# EAGLE design lora-slim (EAGLE 6.5.0)
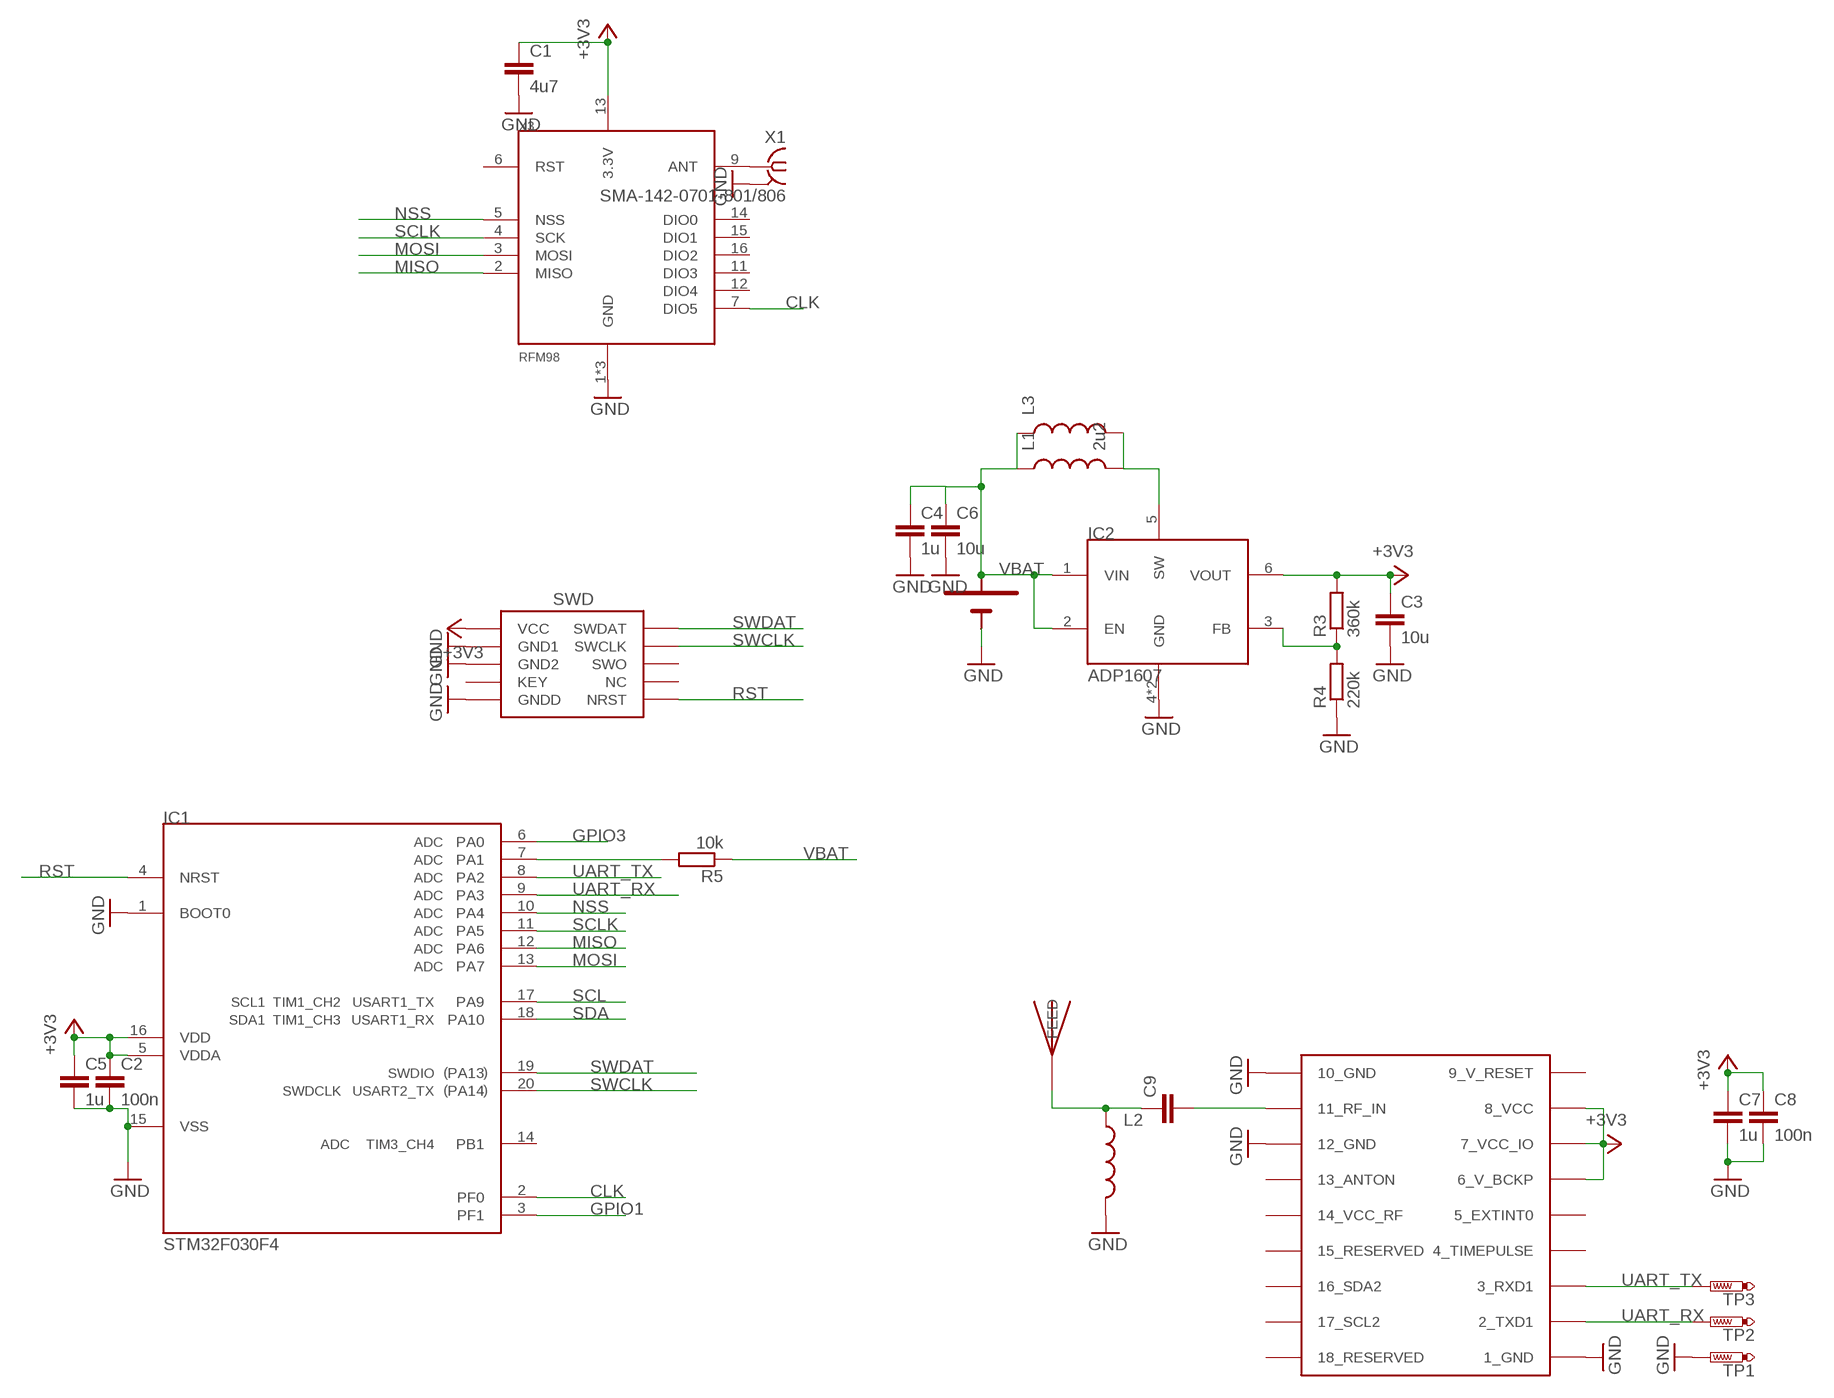
[diagram p0: schematic, sheet 1]

## Parts
C1  4u7  C-EUC0603  [C0603]
C2  100n  C-EUC0603  [C0603]
C3  10u  C-EUC0805  [C0805]
C4  1u  C-EUC0603  [C0603]
C5  1u  C-EUC0603  [C0603]
C6  10u  C-EUC0805  [C0805]
C7  1u  C-EUC0603  [C0603]
C8  100n  C-EUC0603  [C0603]
C9  C-EUC0603  [C0603]
IC1  STM32F030F4  [TSSOP20]
IC2  ADP1607  [LFCSP6]
J1  SWD_PTH_SHROUD  [SWD_PTH_SHROUD]
L1  2u2  INDUCTOR0805  [0805]
L2  INDUCTOR0603  [0603]
L3  INDUCTOR1210  [1210]
R3  360k  R-EU_R0603  [R0603]
R4  220k  R-EU_R0603  [R0603]
R5  10k  R-EU_R0603  [R0603]
TP1  PTR1B1,27  [B1,27]
TP2  PTR1B1,27  [B1,27]
TP3  PTR1B1,27  [B1,27]
U$5  JTI_ANTENNA-1575AT43A40  [JTI_ANTENNA-1575AT43A40]
U$6  KEYSTONE-53  [KEYSTONE53]
X1  SMA-142-0701-801/806  [J502-ND-142-0701-801/806]
X2  UBLOX_MAX  [UBLOX_MAX]
X3  RFM98  [RFM97]

## Nets
+3V3: C1.1 C2.1 C3.1 C5.1 C7.1 C8.1 IC1.5(VDDA) IC1.16(VDD) IC2.6(VOUT) J1.1(VCC) R3.2 X2.6_V_BCKP X2.7_VCC_IO X2.8_VCC X3.13(3.3V)
CLK: IC1.2(PF0) X3.7(DIO5)
GND: C1.2 C2.2 C3.2 C4.2 C5.2 C6.2 C7.2 C8.2 IC1.1(BOOT0) IC1.15(VSS) IC2.4(GND) IC2.EP(GND) J1.3(GND1) J1.5(GND2) J1.9(GNDD) L2.2 R4.1 TP1.TP U$6.N1(-) U$6.N2(-) X1.G@1 X1.G@2 X1.G@3 X1.G@4 X2.1_GND X2.10_GND X2.12_GND X3.1(GND) X3.8(GND) X3.10(GND)
GPIO1: IC1.3(PF1)
GPIO3: IC1.6(PA0)
MISO: IC1.12(PA6) X3.2(MISO)
MOSI: IC1.13(PA7) X3.3(MOSI)
N$1: C9.2 X2.11_RF_IN
N$2: X1.1 X3.9(ANT)
N$3: IC2.5(SW) L1.2 L3.2
N$4: C9.1 L2.1 U$5.FEED
N$6: IC2.3(FB) R3.1 R4.2
N$9: IC1.7(PA1) R5.2
NSS: IC1.10(PA4) X3.5(NSS)
RST: IC1.4(NRST) J1.10(NRST)
SCL: IC1.17(PA9)
SCLK: IC1.11(PA5) X3.4(SCK)
SDA: IC1.18(PA10)
SWCLK: IC1.20(PA14) J1.4(SWCLK)
SWDAT: IC1.19(PA13) J1.2(SWDAT)
UART_RX: IC1.9(PA3) TP2.TP X2.2_TXD1
UART_TX: IC1.8(PA2) TP3.TP X2.3_RXD1
VBAT: C4.1 C6.1 IC2.1(VIN) IC2.2(EN) L1.1 L3.1 R5.1 U$6.P1(+) U$6.P2(+)
Unconnected: IC1.14(PB1) J1.6(SWO) J1.7(KEY) J1.8(NC) X2.4_TIMEPULSE X2.5_EXTINT0 X2.13_ANTON X2.14_VCC_RF X2.15_RESERVED X2.16_SDA2 X2.17_SCL2 X2.18_RESERVED X3.6(RST) X3.11(DIO3) X3.12(DIO4) X3.14(DIO0) X3.15(DIO1) X3.16(DIO2)

## Power pins joined to a net without a drawn wire
9_V_RESET: X2.9_V_RESET

## Library data of the parts
C1-C9 = rcl:C-EU: CAPACITOR, European symbol
IC1 = dtb:STM32F030F4
IC2 = Mine:ADP1607
J1 = dtb:SWD_PTH_SHROUD
L1-L3 = SparkFun-Passives:INDUCTOR: Inductors Basic Inductor/Choke - 0603 and 1206. Footprints are not proven and vary greatly between part numbers. SRN6045- 33uH, 20% 1.4A SDR0403-560KL - 56uH, 10%, 500mA RMS/740mA peak
R3-R5 = rcl:R-EU_: RESISTOR, European symbol
TP1-TP3 = testpad:PTR1: TEST PIN
U$5 = Ava:JTI_ANTENNA-1575AT43A40
U$6 = Mine:KEYSTONE-53
X1 = con-coax:SMA-: SMA 50 Ohm End Launch Jack Receptacle - Round Contact Johnson Components Source: www.johnsoncomponents.com .. J502-ND.pdf; MF: JOHNSON COMPONENTS; MPN: 142-0701-801; OC_FARNELL: 1608592; OC_NEWARK: 90F2624
X2 = Ava:UBLOX_MAX: UBLOX MAX
X3 = Mine:RFM98

## Board
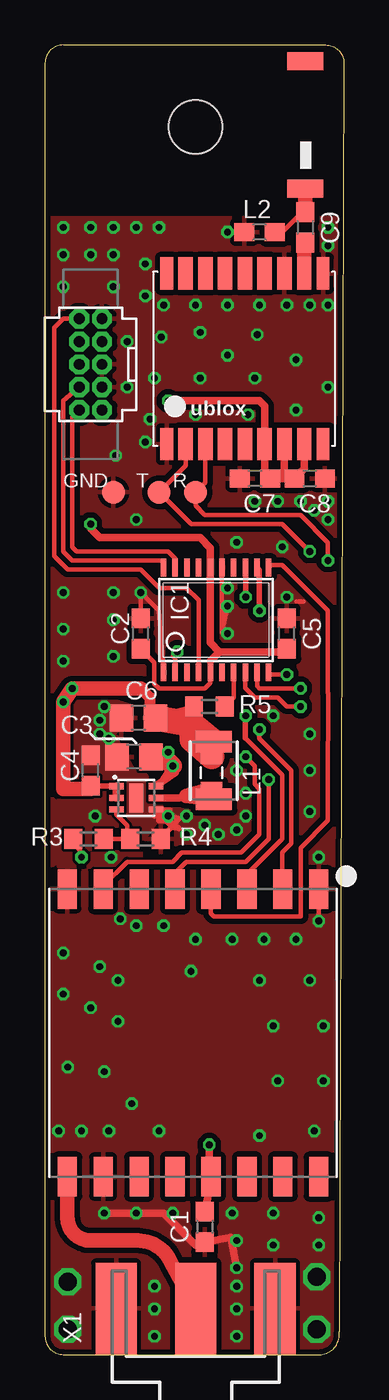
[diagram p1: board, top side]
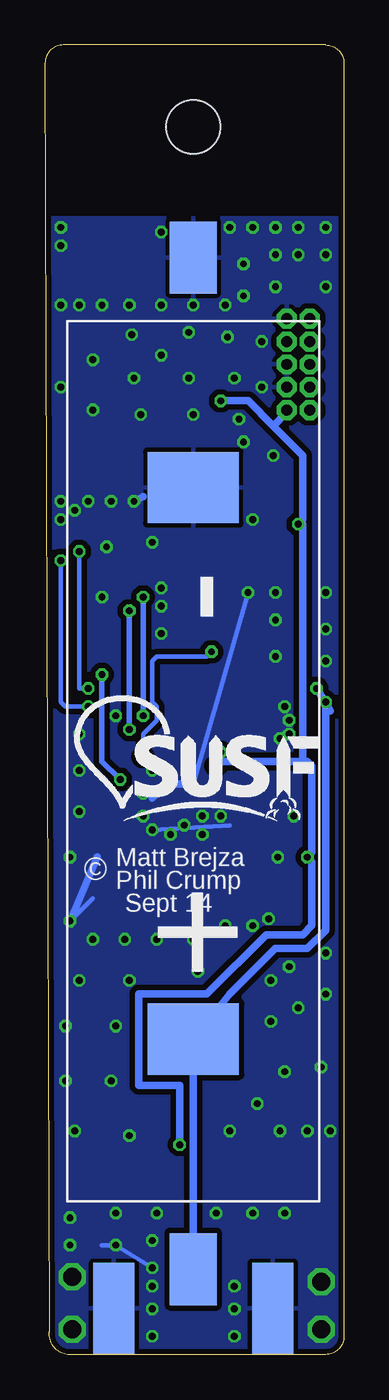
[diagram p2: board, bottom side, seen from below]

Size 16.64 x 72.9 mm. Coordinates in mm from the lower left corner, seen from the top.
Outline: 1.02,0 15.37,0 arc90 16.38,1.27 16.64,71.88 arc90 15.62,72.9 1.02,72.9 arc90 0,71.88 0,1.02 arc90 1.02,0
Copper layers (1*16): Top 0.035mm / dielectric 1.5mm / Bottom 0.035mm
Design rules "Hackvana *": minimum track width 7mil, minimum drill 12mil, track to track 6mil, track to pad 6mil, pad to pad 6mil, via to via 6mil, smd to smd 0mil, copper to edge 10mil, drill to drill 6mil, minimum pad ring 10mil, minimum via ring 6mil, stop-mask expansion 2mil, vias tented up to drill 100mil, thermal gap 10mil
Holes 3 mm at 8.38,68.33

### Footprints (pad centres in the part's own frame; a part is rotated, then mirrored left to right if it is on the bottom)
C0603 = smd 1.1 x 1: 1 -0.85,0; 2 0.85,0
C0805 = smd 1.3 x 1.5: 1 -0.95,0; 2 0.95,0
TSSOP20 = smd 0.305 x 0.991: 1 -2.925,-2.918; 2 -2.275,-2.918; 3 -1.625,-2.918; 4 -0.975,-2.918; 5 -0.325,-2.918; 6 0.325,-2.918; 7 0.975,-2.918; 8 1.625,-2.918; 9 2.275,-2.918; 10 2.925,-2.918; 11 2.925,2.918; 12 2.275,2.918; 13 1.625,2.918; 14 0.975,2.918; 15 0.325,2.918; 16 -0.325,2.918; 17 -0.975,2.918; 18 -1.625,2.918; 19 -2.275,2.918; 20 -2.925,2.918
LFCSP6 = smd 0.35 x 0.8: 1 -0.65,-1.1; 2 0,-1.1; 3 0.65,-1.1; 4 0.65,1.1; 5 0,1.1; 6 -0.65,1.1 | smd 1.6 x 0.8: EP 0,0
SWD_PTH_SHROUD = drill 0.6 octagon: 1 -2.54,-0.635; 2 -2.54,0.635; 3 -1.27,-0.635; 4 -1.27,0.635; 5 0,-0.635; 6 0,0.635; 7 1.27,-0.635; 8 1.27,0.635; 9 2.54,-0.635; 10 2.54,0.635
0805 = smd 0.8 x 1.2: 1 -0.9,0; 2 0.9,0
0603 = smd 1.1 x 1: 1 -0.85,0; 2 0.85,0
1210 = smd 1.2 x 2: 1 -1.6,0; 2 1.6,0
R0603 = smd 1 x 1.1: 1 -0.85,0; 2 0.85,0
B1,27 = smd 1.27 x 1.27: TP 0,0
JTI_ANTENNA-1575AT43A40 = smd 1 x 2: FEED -3.175,0; NC 3.925,0
KEYSTONE53 = smd 3.96 x 5.08: N1 14.73,0; P2 -15.97,0 | smd 4 x 2.6: N2 27.53,0; P1 -28.77,0
J502-ND-142-0701-801/806 = smd 5.08 x 2.286: 1 2.565,0; G@1 2.565,4.42; G@2 2.565,-4.42 | smd 5.08 x 2.286 bottom: G@3 2.565,4.42; G@4 2.565,-4.42
UBLOX_MAX = smd 1.8 x 0.7: 1_GND 4.95,-4.4; 9_V_RESET 4.95,4.3; 10_GND -4.55,4.3; 18_RESERVED -4.55,-4.4 | smd 1.8 x 0.8: 2_TXD1 4.95,-3.35; 3_RXD1 4.95,-2.25; 4_TIMEPULSE 4.95,-1.15; 5_EXTINT0 4.95,-0.05; 6_V_BCKP 4.95,1.05; 7_VCC_IO 4.95,2.15; 8_VCC 4.95,3.25; 11_RF_IN -4.55,3.25; 12_GND -4.55,2.15; 13_ANTON -4.55,1.05; 14_VCC_RF -4.55,-0.05; 15_RESERVED -4.55,-1.15; 16_SDA2 -4.55,-2.25; 17_SCL2 -4.55,-3.35
RFM97 = smd 2.184 x 1.067: 1 0,0; 2 0,-2; 3 0,-4; 4 0,-6; 5 0,-8; 6 0,-10; 7 0,-12; 8 0,-14; 9 16,-14; 10 16,-12; 11 16,-10; 12 16,-8; 13 16,-6; 14 16,-4; 15 16,-2; 16 16,0

### Placement (x,y rotation side)
C1  8.89,7.11 270 top
C2  5.33,40.13 90 top
C3  4.95,33.27 180 top
C4  2.54,32.51 90 top
C5  13.46,40.13 90 top
C6  5.21,35.43 180 top
C7  11.68,48.77 180 top
C8  14.73,48.77 0 top
C9  14.48,62.74 270 top
IC1  9.53,40.89 0 top
IC2  5.08,30.99 270 top
J1  2.54,55.12 90 top
L1  9.27,32.38 270 top
L2  11.94,62.48 180 top
L3  9.4,32.51 270 top
R3  2.41,28.7 180 top
R4  5.59,28.7 180 top
R5  9.14,36.07 0 top
TP1  3.81,48.01 0 top
TP2  6.35,48.01 0 top
TP3  8.38,48.01 0 top
U$1  [SUSF-XSM]  14.99,29.72 0 bottom
U$5  14.48,68.07 90 top
U$6  8.38,33.53 90 bottom
X1  8.38,0 90 top
X2  11.18,55.63 270 top
X3  15.24,25.91 270 top

### Tracks (layer width: path | path; a pad name or v marks a point on that pad's centre or on a via)
+3V3  (via drill 0.38)
  Top 0.254: C5.1 13.63,39.2 | 9.2,38.61 IC1.5 9.2,37.39 8.89,37.08 6.35,37.08 6.1,37.34 6.1,38.52 C2.1 | 9.06,8.13 C1.1 | v2.03,27.69 2.03,27.9 R3.2
  Top 0.406: IC2.6 7.25,32.4 6.6,32 v7.11,32.77 | C1.1 9.06,8.72 9.14,9.65 9.14,10 X3.13 9.14,10.26 v9.14,11.68 | v6.86,53.09 11.94,53.09 12.23,52.8 X2.6_V_BCKP 12.23,49.08 C7.1 | 12.82,49.05 C7.1 | C5.1 13.46,39.12 9.71,39.12 | 9.71,39.12 9.2,38.61 | 9.71,39.12 9.2,39.62 IC1.16 9.2,44.9 8.64,45.47 3.05,45.47 2.54,45.97 v2.54,46.23 | X2.8_VCC 14.43,49.31 C8.1 13.21,48.77 | 13.21,48.77 C7.1 | X2.7_VCC_IO 13.33,48.89 13.21,48.77
  Top 1.016: C3.1 6.6,33.27 v7.11,32.77
  Bottom 0.254: v2.54,46.23 2.29,46.48
  Bottom 0.406: 2.29,33.02 2.29,46.23 v2.54,46.23 | v6.86,53.09 5.33,53.09 3.94,51.69 | v9.14,11.68 9.14,14.99 11.43,14.99 11.43,20.07 7.62,20.07 4.32,23.37 2.29,23.37 1.78,23.88 1.78,27.43 v2.03,27.69 1.78,27.94 1.78,32.77 2.03,33.02 2.29,33.02 | 6.86,33.02 v6.86,33.53 | v7.11,32.77 6.86,33.02 | 2.29,46.48 2.29,50.04 3.94,51.69 | J1.1 3.18,52.45 3.94,51.69 | 6.86,33.02 2.29,33.02
CLK  (via drill 0.38)
  Top 0.254: X3.7 3.24,26.1 4.57,27.43 7.11,27.43 7.62,27.94 10.92,27.94 11.94,28.96 11.94,31.5 11.68,31.75 11.68,32.77 v11.18,33.27 | 7.11,38.86 v7.37,39.12 7.25,39 IC1.2
  Bottom 0.254: v11.18,33.27 11.18,34.54 10.41,35.31 10.41,36.07 10.67,36.32 10.67,38.61 10.41,38.86 7.62,38.86 v7.37,39.12
GND  (via drill 0.38, 1)
  Top 0.254: X3.1 v15.24,24.13 | C2.2 v5.33,42.42 6.35,41.41 IC1.1 | 14.39,41.91 13.97,41.91 | IC1.15 9.85,40.19 v10.16,41.66
  Top 0.305: R4.1 7.45,29.83 IC2.4 | IC2.4 6.94,29.5 7.09,29.35 7.4,29.35 7.46,29.29 | v6.86,29.97 6.1,29.97 | IC2.4 6.94,30.33 6.33,29.72 6.9,29.72 7.3,29.31
  Top 0.406: 5.25,40.89 C2.2 | v10.67,4.83 10.33,6.52 C1.2 8.38,6.1 6.6,7.87 v3.3,7.87 | C7.2 10.83,48.93
  Bottom 0.254: v15.24,24.13 13.97,25.4 | v5.33,42.42 8.38,31.75 | v12.7,6.1 12.45,6.1 | v10.67,4.83 v12.7,6.1 | 13.46,6.1 v12.7,6.1 | v10.67,29.21 6.35,29.46
  Bottom 0.406: 8.38,31.75 9.91,31.75 10.67,30.99 | 13.72,27.69 v15.24,24.13 | v11.68,47.5 11.18,47.75
  other vias: 9.65,28.96 3.05,35.31 3.56,34.29 3.05,34.54 3.3,36.07 4.19,24.26 11.94,12.19 10.16,42.67 6.1,54.36 13.46,58.42 15.75,53.85 5.84,52.07 8.64,56.9 10.16,62.48 15.75,47.5 11.68,54.36 11.94,58.42 14.22,47.5 11.81,56.77 5.59,58.93 6.6,58.42 5.59,60.71 10.16,58.42 14.73,58.42 2.54,62.74 1.02,61.21 15.75,62.74 15.75,61.72 15.75,58.42 8.38,58.42 3.81,62.74 5.08,62.74 4.57,56.39 3.81,59.44 4.57,53.85 13.97,55.37 5.59,50.8 5.08,46.48 8.38,52.32 8.64,54.36 10.16,55.63 10.67,45.21 3.81,61.21 13.46,42.16 1.02,62.74 6.35,62.74 4.06,20.83 5.08,23.88 1.02,22.35 3.05,21.59 10.67,6.35 0.76,12.45 3.56,12.45 14.99,12.45 12.95,15.24 12.7,18.29 11.94,20.83 8.13,21.34 14.73,20.83 4.06,18.54 3.3,15.75 1.27,16 2.54,19.3 10.67,2.54 7.11,7.87 15.24,7.62 10.67,1.02 6.1,2.54 10.41,7.87 11.3,52.32 6.48,56.64 3.94,50.04 1.27,1.4 15.11,1.4 6.1,1.02 1.27,4.06 15.11,4.32 2.54,61.21 1.02,59.44 11.18,31.24 13.97,52.58 3.81,42.42 3.81,40.89 3.81,38.86 1.02,38.61 1.02,40.39 1.02,42.42 3.68,27.69 2.79,29.97 7.87,28.96 8.89,29.46 11.18,29.97 10.67,32.51 14.73,30.23 14.73,34.54 15.24,27.69 13.97,23.11 12.19,23.11 10.41,23.11 8.38,23.11 6.6,23.88 15.49,18.29 15.49,15.24 6.35,12.45 12.7,7.87 15.24,6.1 10.67,3.81 6.1,3.81 5.08,7.87 2.03,12.45 4.83,13.97 1.02,20.07 7.87,29.97 12.7,35.56 14.73,32.51 10.16,40.13 13.21,44.96 14.99,46.99 15.75,46.48 12.95,47.5
  pour Bottom (isolate 0.305): -1.78,63.25 17.02,63.25 16.51,0 -1.78,0.25 -2.03,10.92
  pour Top (isolate 0.305): -1.78,63.25 16.76,63.25 16.76,33.53 -1.78,33.53
  pour Top (no thermals): 1.02,36.32 4.06,36.32 4.83,36.07 4.83,35.56 3.81,34.54 5.08,32.26 5.59,32.26 6.6,30.23 5.33,28.45 5.33,27.43 5.08,27.18 0.76,27.18 0.76,32 0.25,32.51 0.25,35.81
  pour Top (isolate 0.305): -1.02,34.04 16.51,33.78 16.51,25.91 16.26,0 -1.52,0.25 -1.78,0.25
MISO  (via drill 0.38, 0.38 pad 0.25)
  Top 0.254: v11.94,34.8 11.94,34.29 13.72,32.51 13.72,28.45 13.21,27.94 13.21,25.94 X3.2
  Top 0.305: IC1.12 11.94,43.67 v11.94,41.4
  Bottom 0.305: v11.94,41.4 v11.94,34.8
MOSI  (via drill 0.38, 0.38 pad 0.25)
  Top 0.254: 11.15,34.32 13.21,32.26 13.21,28.7 11.18,26.67 11.43,25.91 11.43,25.84 X3.3
  Top 0.305: IC1.13 11.18,43.79 v11.18,42.16 | 11.15,34.32 11.15,35.53 v11.18,35.56
  Bottom 0.305: v11.18,42.16 v11.18,35.56
N$1
  Top 0.813: X2.11_RF_IN 14.43,61.84 C9.2
N$2
  Top 0.813: X3.9 1.24,8.67 1.25,7.6 arc89 2.52,6.35 5.16,6.35 arc-62 6.91,5.3 X1.1
N$3
  Top 0.406: IC2.5 7.48,30.99 L1.2
  Top 0.813: L3.2 7.87,31.1 L1.2
N$4
  Top 0.254: C9.1 14.31,63.59 13.21,62.48 L2.1
  Top 0.813: U$5.FEED C9.1
N$6
  Top 0.254: IC2.3 3.98,30.06 4.57,29.46 4.57,28.74 R3.1 R4.2
N$9
  Top 0.254: IC1.7 10.5,36.57 R5.2
NSS  (via drill 0.38)
  Top 0.254: X3.5 7.24,26.8 7.87,27.43 11.18,27.43 12.45,28.7 12.45,31.88 | v13.46,37.85 12.58,37.85 IC1.10
  Top 0.305: 12.45,31.88 v12.45,32
  Bottom 0.305: v12.45,32 13.46,33.02 v13.46,37.85
RST
  Top 0.254: J1.10 1.02,57.66 0.51,57.15 0.51,44.45 1.27,43.69 5.33,43.69 6.35,42.67 7.87,42.67 8.55,42 IC1.4
SCLK
  Top 0.254: X3.4 9.24,24.54 9.4,24.38 14.22,24.38 14.22,28.19 15.75,29.72 15.75,31.5 15.75,36.83 15.75,41.4 13.21,43.94 12.58,43.94 IC1.11
SWCLK
  Top 0.254: IC1.20 6.6,43.95 6.6,44.2 1.52,44.2 1.02,44.7 1.02,53.09 J1.4
SWDAT
  Top 0.254: IC1.19 7.25,44.31 6.86,44.7 1.78,44.7 1.52,44.96 1.52,52.2 J1.2 1.9,52.45
UART_RX  (via drill 0.38)
  Top 0.254: 5.84,48.01 TP2.TP | X2.2_TXD1 7.83,49.48 TP2.TP | v14.73,44.7 13.21,46.23 8.13,46.23 TP2.TP | IC1.9 11.8,37.22 11.94,37.08 v14.22,37.08
  Bottom 0.254: v14.73,44.7 14.73,37.08 v14.22,37.08
UART_TX  (via drill 0.38)
  Top 0.254: v15.75,44.2 15.75,45.21 14.22,46.74 8.89,46.74 8.38,47.24 TP3.TP 8.93,48.55 X2.3_RXD1 | IC1.8 11.15,37.11 11.68,36.58 12.95,36.58 13.46,36.07 v14.22,36.07
  Bottom 0.254: v15.75,44.2 15.75,36.32 15.49,36.07 v14.22,36.07
VBAT  (via drill 0.38)
  Top 0.254: R5.1 6.35,35.56 6.1,36.07 6.1,35.81 6.28,35.56 C6.1
  Top 0.305: IC2.1 2.56,31.64 C4.1
  Top 0.406: IC2.2 IC2.1 | 6.35,35.56 6.35,35.75 C6.1
  Top 0.61: 5.33,37.08 5.84,36.58 5.84,35.75 C6.1 | 2.54,31.5 C4.1
  Top 0.813: 5.33,37.08 v1.52,37.08 v1.02,36.32 v1.03,36.32 1.02,32.77 1.02,31.48 2.54,31.5 2.54,31.48
  Top 1.422: C6.1 8.19,35.07 | L1.1 8.19,34.23 8.19,35.07 | 8.19,35.07 L3.1
  Bottom 0.406: 0.76,35.81 v1.52,37.08 | U$6.P1 U$6.P2 6.35,20.07 3.81,22.61 2.03,22.61 1.02,23.62 v1.02,36.32

### Text on the board
tPlace: GND | T | R
bPlace: Matt Brejza | Phil Crump | © | Sept 14